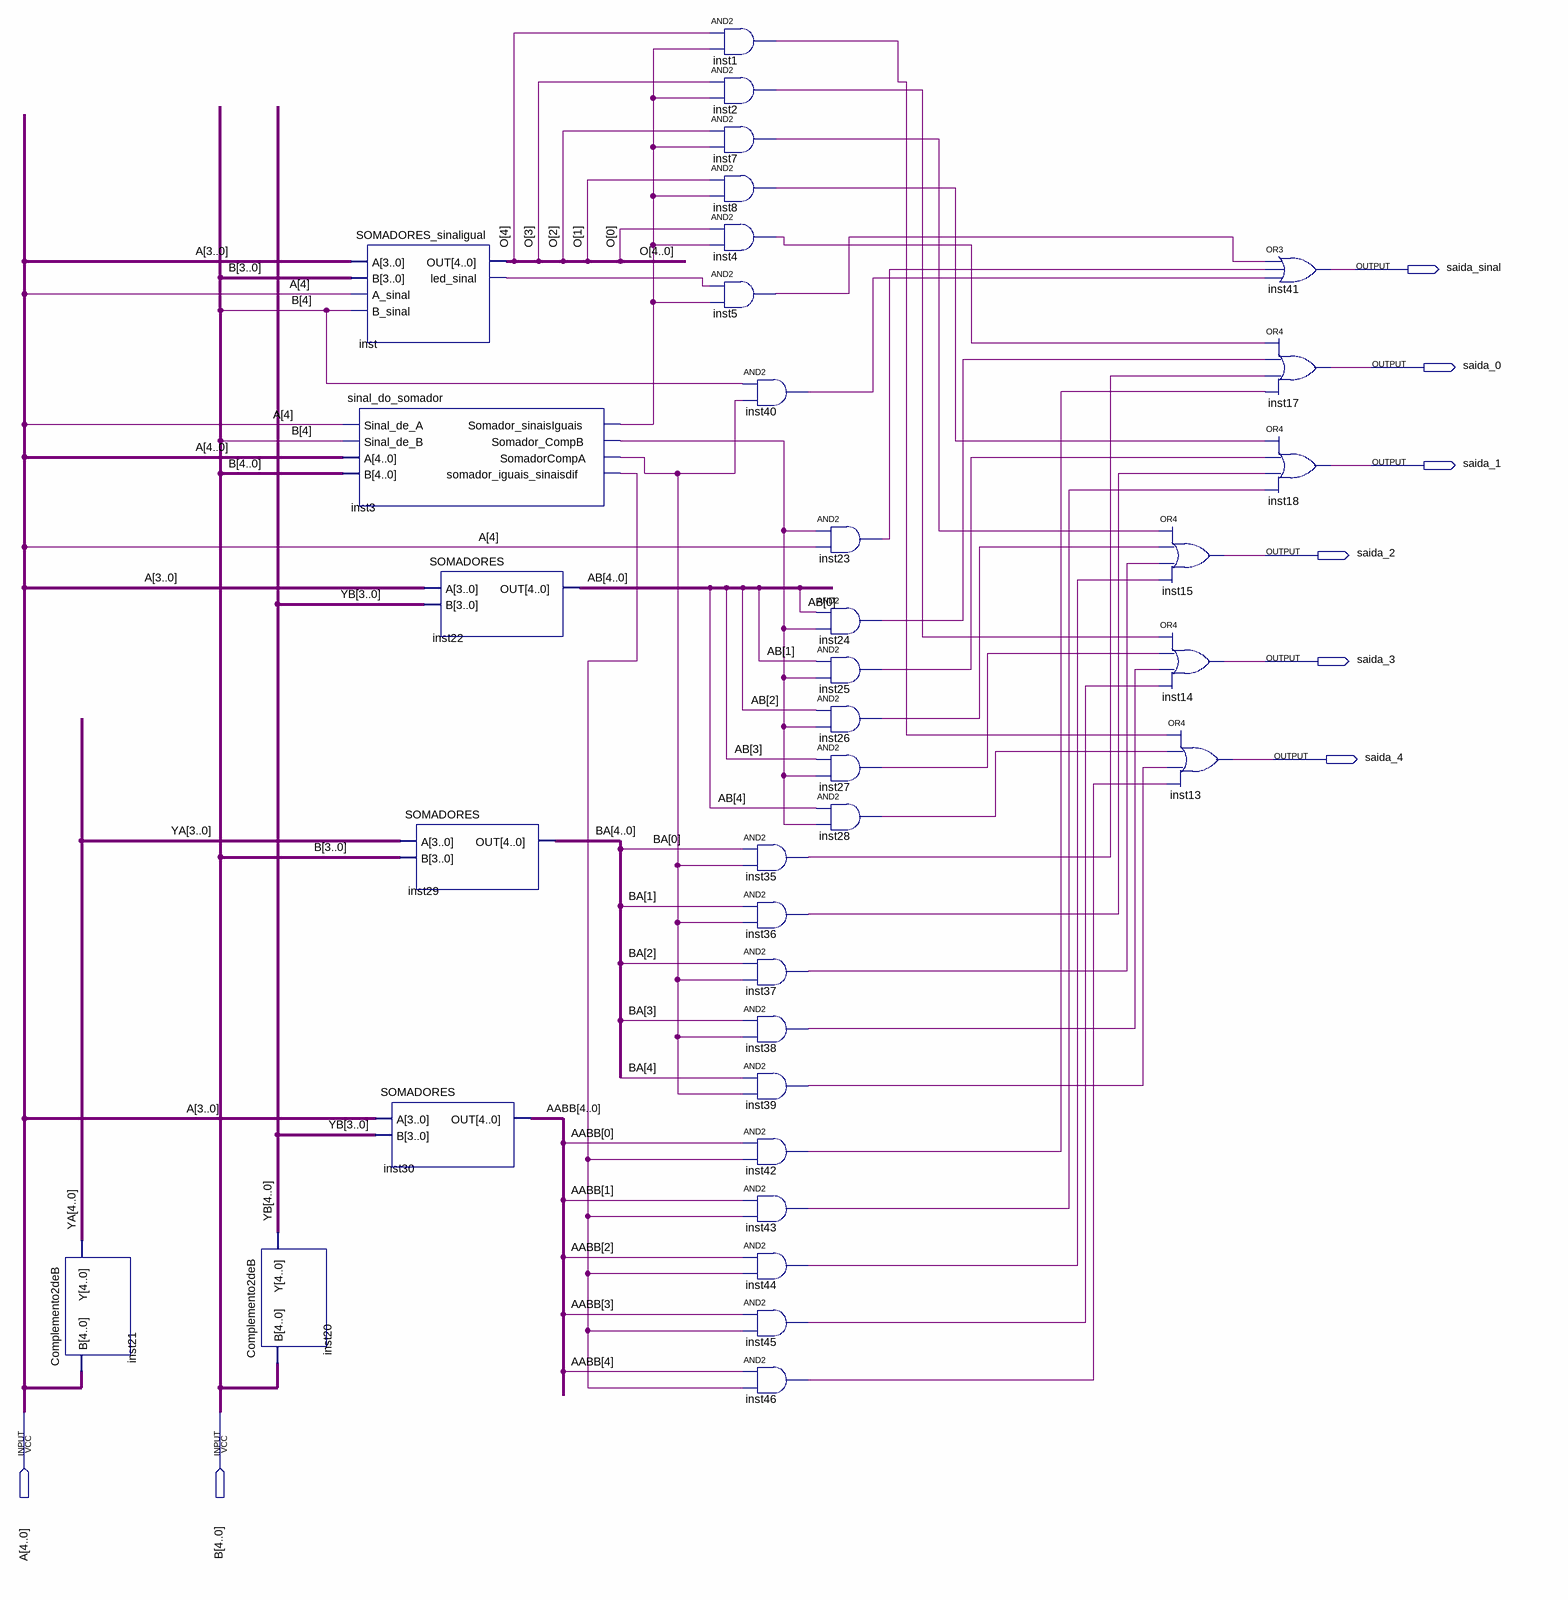
[diagram p0: schematic sheet]
// Quartus schematic somadorzao.bdf as structural Verilog: 36 symbols, 8 pins
module somadorzao (
  input  [4:0] A,
  input  [4:0] B,
  output saida_sinal,
  output saida_0,
  output saida_1,
  output saida_2,
  output saida_3,
  output saida_4
);

  wire inst1_out, inst2_out, inst3_somador_compb, inst3_somador_iguais_sinaisdif, inst3_somador_sinaisiguais,
       inst3_somadorcompa, inst4_out, inst5_out, inst7_out, inst8_out, inst23_out, inst24_out, inst25_out,
       inst26_out, inst27_out, inst28_out, inst35_out, inst36_out, inst37_out, inst38_out, inst39_out,
       inst40_out, inst42_out, inst43_out, inst44_out, inst45_out, inst46_out, inst_led_sinal;
  wire [4:0] AABB, AB, BA, O, YA, YB;

  Complemento2deB inst21 (.B(A), .Y(YA));
  Complemento2deB inst20 (.B(B), .Y(YB));
  SOMADORES_sinaligual inst (
    .A(A[3:0]), .B(B[3:0]), .A_sinal(A[4]), .B_sinal(B[4]), .OUT(O), .led_sinal(inst_led_sinal));
  sinal_do_somador inst3 (
    .Sinal_de_A(A[4]), .Sinal_de_B(B[4]), .A(A), .B(B), .Somador_sinaisIguais(inst3_somador_sinaisiguais),
    .Somador_CompB(inst3_somador_compb), .SomadorCompA(inst3_somadorcompa),
    .somador_iguais_sinaisdif(inst3_somador_iguais_sinaisdif));
  SOMADORES inst29 (.A(YA[3:0]), .B(B[3:0]), .OUT(BA));
  SOMADORES inst30 (.A(A[3:0]), .B(YB[3:0]), .OUT(AABB));
  SOMADORES inst22 (.A(A[3:0]), .B(YB[3:0]), .OUT(AB));
  and inst1 (inst1_out, O[4], inst3_somador_sinaisiguais);
  and inst2 (inst2_out, O[3], inst3_somador_sinaisiguais);
  and inst7 (inst7_out, O[2], inst3_somador_sinaisiguais);
  and inst8 (inst8_out, O[1], inst3_somador_sinaisiguais);
  and inst4 (inst4_out, O[0], inst3_somador_sinaisiguais);
  and inst5 (inst5_out, inst_led_sinal, inst3_somador_sinaisiguais);
  and inst40 (inst40_out, B[4], inst3_somadorcompa);
  and inst35 (inst35_out, BA[0], inst3_somadorcompa);
  and inst36 (inst36_out, BA[1], inst3_somadorcompa);
  and inst37 (inst37_out, BA[2], inst3_somadorcompa);
  and inst38 (inst38_out, BA[3], inst3_somadorcompa);
  and inst39 (inst39_out, BA[4], inst3_somadorcompa);
  and inst42 (inst42_out, AABB[0], inst3_somador_iguais_sinaisdif);
  and inst43 (inst43_out, AABB[1], inst3_somador_iguais_sinaisdif);
  and inst44 (inst44_out, AABB[2], inst3_somador_iguais_sinaisdif);
  and inst45 (inst45_out, AABB[3], inst3_somador_iguais_sinaisdif);
  and inst46 (inst46_out, AABB[4], inst3_somador_iguais_sinaisdif);
  and inst23 (inst23_out, inst3_somador_compb, A[4]);
  and inst24 (inst24_out, AB[0], inst3_somador_compb);
  and inst25 (inst25_out, AB[1], inst3_somador_compb);
  and inst26 (inst26_out, AB[2], inst3_somador_compb);
  and inst27 (inst27_out, AB[3], inst3_somador_compb);
  and inst28 (inst28_out, AB[4], inst3_somador_compb);
  or inst15 (saida_2, inst7_out, inst26_out, inst37_out, inst44_out);
  or inst14 (saida_3, inst2_out, inst27_out, inst38_out, inst45_out);
  or inst13 (saida_4, inst1_out, inst28_out, inst39_out, inst46_out);
  or inst41 (saida_sinal, inst5_out, inst23_out, inst40_out);
  or inst17 (saida_0, inst4_out, inst24_out, inst35_out, inst42_out);
  or inst18 (saida_1, inst8_out, inst25_out, inst36_out, inst43_out);
endmodule
